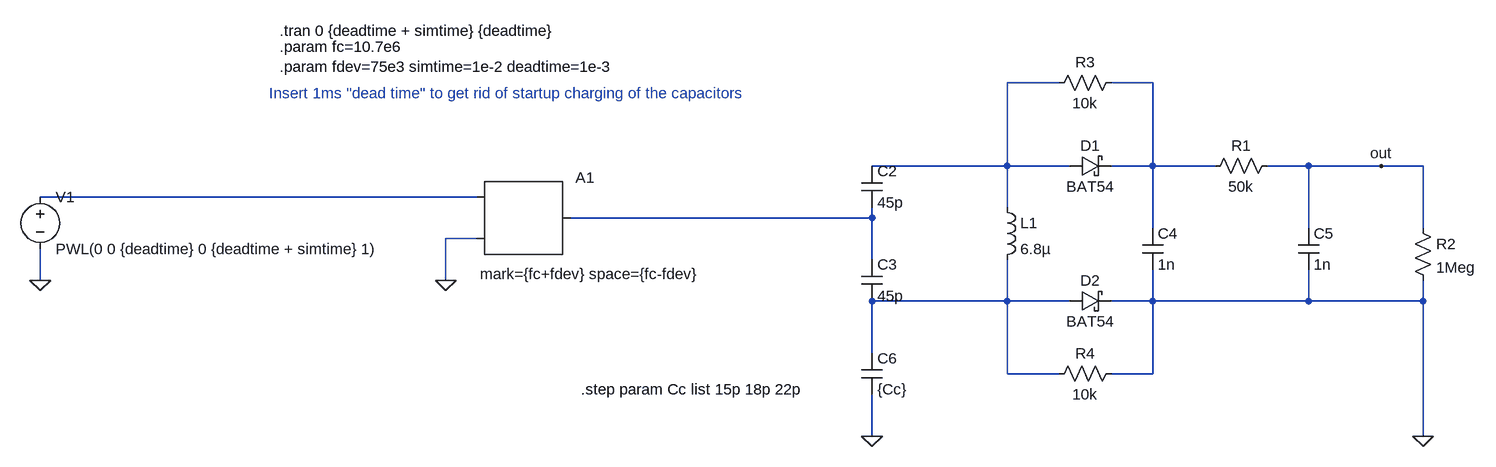
[diagram p0: schematic Weiss_discriminator_linearity.asc]
Weiss_discriminator_linearity.asc, the LTspice schematic file:
Version 4
SHEET 1 1576 680
WIRE 928 -96 848 -96
WIRE 1072 -96 1008 -96
WIRE 848 32 848 -96
WIRE 848 32 640 32
WIRE 944 32 848 32
WIRE 1072 32 1072 -96
WIRE 1072 32 1008 32
WIRE 1168 32 1072 32
WIRE 1312 32 1248 32
WIRE 1424 32 1312 32
WIRE 1488 32 1424 32
WIRE 32 80 -640 80
WIRE 848 96 848 32
WIRE 640 112 640 96
WIRE 640 112 176 112
WIRE 1072 128 1072 32
WIRE 1312 128 1312 32
WIRE 1488 128 1488 32
WIRE 32 144 -16 144
WIRE 640 176 640 112
WIRE -640 208 -640 160
WIRE -16 208 -16 144
WIRE 848 240 848 176
WIRE 848 240 640 240
WIRE 944 240 848 240
WIRE 1072 240 1072 192
WIRE 1072 240 1008 240
WIRE 1312 240 1312 192
WIRE 1312 240 1072 240
WIRE 1488 240 1488 208
WIRE 1488 240 1312 240
WIRE 640 320 640 240
WIRE 848 352 848 240
WIRE 928 352 848 352
WIRE 1072 352 1072 240
WIRE 1072 352 1008 352
WIRE 640 448 640 384
WIRE 1488 448 1488 240
FLAG -16 208 0
FLAG -640 208 0
FLAG 640 448 0
FLAG 1488 448 0
FLAG 1424 32 out
SYMBOL SpecialFunctions\\modulate 32 80 R0
WINDOW 3 5 118 Left 2
SYMATTR Value mark={fc+fdev} space={fc-fdev}
SYMATTR InstName A1
SYMBOL voltage -640 64 R0
WINDOW 123 0 0 Left 0
WINDOW 39 0 0 Left 0
SYMATTR InstName V1
SYMATTR Value PWL(0 0 {deadtime} 0 {deadtime + simtime} 1)
SYMBOL ind 832 80 R0
SYMATTR InstName L1
SYMATTR Value 6.8µ
SYMBOL cap 624 32 R0
SYMATTR InstName C2
SYMATTR Value 45p
SYMBOL cap 624 176 R0
SYMATTR InstName C3
SYMATTR Value 45p
SYMBOL schottky 944 48 R270
WINDOW 0 32 32 VTop 2
WINDOW 3 0 32 VBottom 2
SYMATTR InstName D1
SYMATTR Value BAT54
SYMATTR Description Diode
SYMATTR Type diode
SYMBOL schottky 944 256 R270
WINDOW 0 32 32 VTop 2
WINDOW 3 0 32 VBottom 2
SYMATTR InstName D2
SYMATTR Value BAT54
SYMATTR Description Diode
SYMATTR Type diode
SYMBOL cap 1056 128 R0
SYMATTR InstName C4
SYMATTR Value 1n
SYMBOL res 1264 16 R90
WINDOW 0 0 56 VBottom 2
WINDOW 3 32 56 VTop 2
SYMATTR InstName R1
SYMATTR Value 50k
SYMBOL cap 1296 128 R0
SYMATTR InstName C5
SYMATTR Value 1n
SYMBOL res 1472 112 R0
SYMATTR InstName R2
SYMATTR Value 1Meg
SYMBOL cap 624 320 R0
SYMATTR InstName C6
SYMATTR Value {Cc}
SYMBOL res 1024 -112 R90
WINDOW 0 0 56 VBottom 2
WINDOW 3 32 56 VTop 2
SYMATTR InstName R3
SYMATTR Value 10k
SYMBOL res 1024 336 R90
WINDOW 0 0 56 VBottom 2
WINDOW 3 32 56 VTop 2
SYMATTR InstName R4
SYMATTR Value 10k
TEXT -272 -176 Left 2 !.tran 0 {deadtime + simtime} {deadtime}
TEXT -272 -152 Left 2 !.param fc=10.7e6\n.param fdev=75e3 simtime=1e-2 deadtime=1e-3
TEXT 192 376 Left 2 !.step param Cc list 15p 18p 22p
TEXT -288 -80 Left 2 ;Insert 1ms "dead time" to get rid of startup charging of the capacitors

The netlist it stands for:
* Weiss_discriminator_linearity.asc
A1 N003 0 0 0 0 0 N004 0 MODULATOR mark={fc+fdev} space={fc-fdev}
V1 N003 0 PWL(0 0 {deadtime} 0 {deadtime + simtime} 1)
L1 N001 N005 6.8µ
C2 N001 N004 45p
C3 N004 N005 45p
D1 N001 N002 BAT54
D2 N005 0 BAT54
C4 N002 0 1n
R1 out N002 50k
C5 out 0 1n
R2 out 0 1Meg
C6 N005 0 {Cc}
R3 N002 N001 10k
R4 0 N005 10k
.model D D
.lib standard.dio
.tran 0 {deadtime + simtime} {deadtime}
.param fc=10.7e6
.param fdev=75e3 simtime=1e-2 deadtime=1e-3
.step param Cc list 15p 18p 22p
* Insert 1ms "dead time" to get rid of startup charging of the capacitors
.backanno
.end